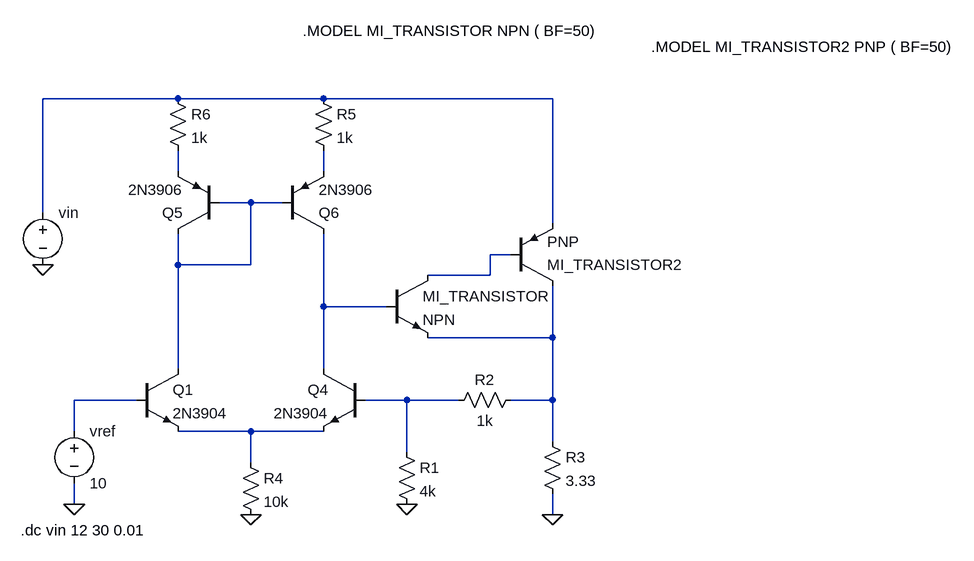
[diagram p0: schematic esquematico_circuitos2.asc]
esquematico_circuitos2.asc, the LTspice schematic file:
Version 4
SHEET 1 1440 680
WIRE -112 -400 -320 -400
WIRE 112 -400 -112 -400
WIRE 464 -400 112 -400
WIRE -112 -288 -112 -320
WIRE 112 -288 112 -320
WIRE 0 -240 -48 -240
WIRE 48 -240 0 -240
WIRE -320 -224 -320 -400
WIRE 464 -208 464 -400
WIRE 400 -160 368 -160
WIRE -112 -144 -112 -192
WIRE 0 -144 0 -240
WIRE 0 -144 -112 -144
WIRE 368 -128 368 -160
WIRE 368 -128 272 -128
WIRE 112 -80 112 -192
WIRE 208 -80 112 -80
WIRE 464 -32 464 -112
WIRE 464 -32 272 -32
WIRE -112 16 -112 -144
WIRE 112 16 112 -80
WIRE -176 64 -272 64
WIRE 240 64 176 64
WIRE 320 64 240 64
WIRE 464 64 464 -32
WIRE 464 64 400 64
WIRE -272 112 -272 64
WIRE 0 112 -112 112
WIRE 112 112 0 112
WIRE 464 128 464 64
WIRE 240 144 240 64
WIRE 0 160 0 112
WIRE -272 224 -272 192
WIRE 464 240 464 208
FLAG 240 224 0
FLAG 464 240 0
FLAG 0 240 0
FLAG -272 224 0
FLAG -320 -144 0
SYMBOL res 224 128 R0
SYMATTR InstName R1
SYMATTR Value 4k
SYMBOL res 416 48 R90
WINDOW 0 0 56 VBottom 2
WINDOW 3 32 56 VTop 2
SYMATTR InstName R2
SYMATTR Value 1k
SYMBOL res 448 112 R0
SYMATTR InstName R3
SYMATTR Value 3.33
SYMBOL npn -176 16 R0
SYMATTR InstName Q1
SYMATTR Value 2N3904
SYMBOL npn 176 16 M0
SYMATTR InstName Q4
SYMATTR Value 2N3904
SYMBOL res -16 144 R0
SYMATTR InstName R4
SYMATTR Value 10k
SYMBOL pnp -48 -192 R180
SYMATTR InstName Q5
SYMATTR Value 2N3906
SYMBOL pnp 48 -192 M180
SYMATTR InstName Q6
SYMATTR Value 2N3906
SYMBOL res 96 -416 R0
SYMATTR InstName R5
SYMATTR Value 1k
SYMBOL res -128 -416 R0
SYMATTR InstName R6
SYMATTR Value 1k
SYMBOL voltage -272 96 R0
SYMATTR InstName vref
SYMATTR Value 10
SYMBOL voltage -320 -240 R0
SYMATTR InstName vin
SYMATTR Value ""
SYMBOL npn 208 -128 R0
SYMATTR InstName MI_TRANSISTOR
SYMBOL pnp 400 -112 M180
SYMATTR InstName MI_TRANSISTOR2
TEXT -354 264 Left 2 !.dc vin 12 30 0.01
TEXT 80 -504 Left 2 !.MODEL MI_TRANSISTOR NPN ( BF=50)
TEXT 616 -480 Left 2 !.MODEL MI_TRANSISTOR2 PNP ( BF=50)

The netlist it stands for:
* esquematico_circuitos2.asc
R1 N009 0 4k
R2 N007 N009 1k
R3 N007 0 3.33
Q1 N004 N008 N010 0 2N3904
Q4 N006 N009 N010 0 2N3904
R4 N010 0 10k
Q5 N004 N004 N002 0 2N3906
Q6 N006 N004 N003 0 2N3906
R5 N001 N003 1k
R6 N001 N002 1k
vref N008 0 10
vin N001 0
Q§MI_TRANSISTOR N005 N006 N007 0 NPN
Q§MI_TRANSISTOR2 N007 N005 N001 0 PNP
.model NPN NPN
.model PNP PNP
.lib standard.bjt
.dc vin 12 30 0.01
.MODEL MI_TRANSISTOR NPN ( BF=50)
.MODEL MI_TRANSISTOR2 PNP ( BF=50)
.backanno
.end